# Altium schematic sheet chanel.SchDoc
size A2
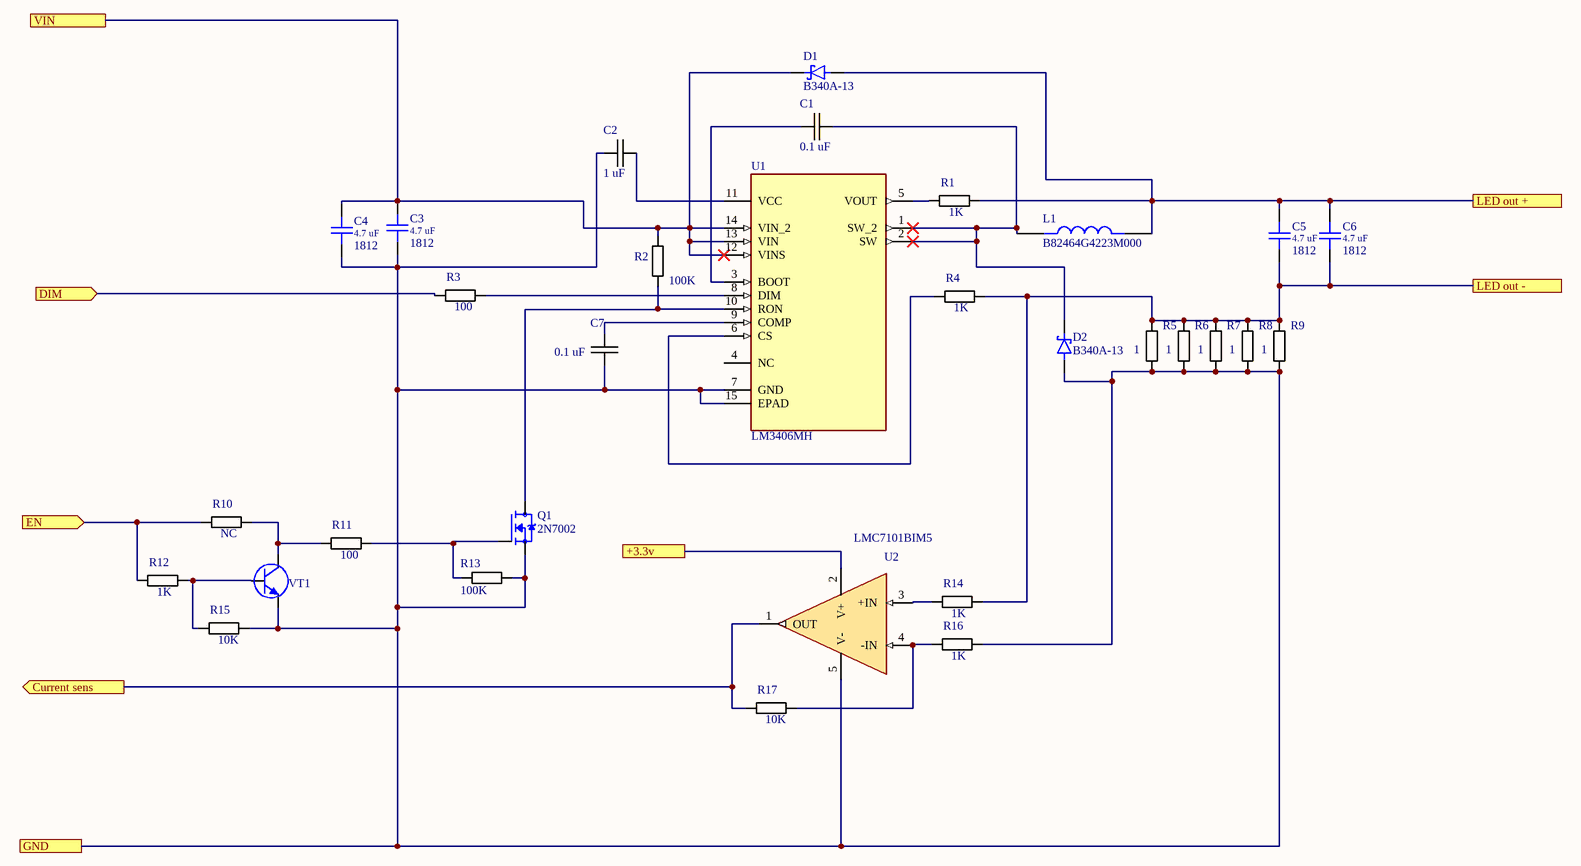
[diagram p0: chanel.SchDoc]

## Parts
C1  0.1 uF  [CAPACITOR 0603]
C2  1 uF  [CAPACITOR 0603]
C3  value 4.7 uF  Package: 1812  [CAPCHIP1812]  (hidden comment: Cap C)
C4  value 4.7 uF  Package: 1812  [CAPCHIP1812]  (hidden comment: Cap C)
C5  value 4.7 uF  Package: 1812  [CAPCHIP1812]  (hidden comment: Cap C)
C6  value 4.7 uF  Package: 1812  [CAPCHIP1812]  (hidden comment: Cap C)
C7  0.1 uF  [CAPACITOR 0603]
D1  B340A-13  [DIOM5226X240N]
D2  B340A-13  [DIOM5226X240N]
L1  B82464G4223M000  [IND_B82464G4223M000]
Q1  2N7002  [SOT95P240X111-3N]
R1  1K  [Resistor 0402]
R2  100K  [Resistor 0402]
R3  100  [Resistor 0402]
R4  1K  [Resistor 0402]
R5  1  [Resistor 1206]
R6  1  [Resistor 1206]
R7  1  [Resistor 1206]
R8  1  [Resistor 1206]
R9  1  [Resistor 1206]
R10  NC  [Resistor 0402]
R11  100  [Resistor 0402]
R12  1K  [Resistor 0402]
R13  100K  [Resistor 0402]
R14  1K  [Resistor 0402]
R15  10K  [Resistor 0402]
R16  1K  [Resistor 0402]
R17  10K  [Resistor 0402]
U1  LM3406MH  [SOP65P640X110-15N]
U2  LMC7101BIM5  [*SOT95P280X145-5N]
VT1  NPN BEC  [SOT23]  (value not drawn)

## Ports
+3.3v, Current sens (out), DIM (in), EN (in), GND, LED out +, LED out -, VIN

## Nets
+3.3v: U2.2(V+) ; port +3.3v
Current sens: R17.2 U2.1(OUT) ; port Current sens
DIM: R3.2 ; port DIM
EN: R10.2 R12.2 ; port EN
GND: C2.2 C3.1 C4.1 C7.2 D2.A Q1.2(S) R5.2 R6.2 R7.2 R8.2 R9.2 R13.1 R15.1 R16.1 U1.7(GND) U1.15(EPAD) U2.5(V-) VT1.2(E) ; port GND
LED out +: C5.2 C6.2 D1.A L1.2 R1.1 ; port LED out +
LED out -: C5.1 C6.1 R4.1 R5.1 R6.1 R7.1 R8.1 R9.1 R14.1 ; port LED out -
VIN: C3.2 C4.2 D1.C R2.2 U1.12(VINS) U1.13(VIN) U1.14(VIN_2) ; port VIN
NetC1_1: C1.1 D2.C L1.1 U1.1(SW_2) U1.2(SW)
NetC1_2: C1.2 U1.3(BOOT)
NetC2_1: C2.1 U1.11(VCC)
NetC7_1: C7.1 U1.9(COMP)
NetQ1_1: Q1.1(G) R11.1 R13.2
NetQ1_3: Q1.3(D) R2.1 U1.10(RON)
NetR1_2: R1.2 U1.5(VOUT)
NetR3_1: R3.1 U1.8(DIM)
NetR4_2: R4.2 U1.6(CS)
NetR10_1: R10.1 R11.2 VT1.3(C)
NetR12_1: R12.1 R15.2 VT1.1(B)
NetR14_2: R14.2 U2.3(+IN)
NetR16_2: R16.2 R17.1 U2.4(-IN)

Not connected (* = marked no-connect by the designer): U1 4(NC)

## Library data of the parts
C1 C2 C7 = Capasitor: Package: 0603
  C1 C7: Value: 0.1 uF
  C2: Value: 1 uF
C3-C6 = Cap C: Ceramic Capacitor; Class: Электронные компоненты; SubClass: Конденсаторы; TKE: {TKE}; Ordering_Information: {Ordering_Information}; Installation: {Installation}; Body: {Body}; Nominal_voltage_V: {Nominal_voltage_V}; Tolerance_Percent: {Tolerance_Percent}; Pins: {Pins}
D1 D2 = B340A-13: Diode Schottky 40 V 3A Surface Mount SMA; MF: Diodes Inc.; Value: *; MP: B340A-13; Package: DO-214 Diodes Inc.; Availability: In Stock; Price: None; SnapEDA_Link: https://www.snapeda.com/parts/B340A-13/Diodes+Inc./view-part/?ref=snap; Check_prices: https://www.snapeda.com/parts/B340A-13/Diodes+Inc./view-part/?ref=eda; Purchase-URL: https://pricing.snapeda.com/search/part/B340A-13/?ref=eda
L1 = B82464G4223M000: MF: TDK ELECTRONICS; Check_prices: https://www.snapeda.com/parts/B82464G4223M000/TM+Electronics/view-part/?ref=eda; Package: None; Value: *; MP: B82464G4223M000; SnapEDA_Link: https://www.snapeda.com/parts/B82464G4223M000/TM+Electronics/view-part/?ref=snap; Purchase-URL: https://pricing.snapeda.com/search/part/B82464G4223M000/?ref=eda
Q1 = 2N7002: N-Channel 60V 280mA (Ta) 350mW (Ta) Surface Mount SOT-23-3 (TO-236); MP: altium_native_batch; Package: None; Price: None; Availability: Unavailable; Value: *
R1-R17 = Resistor
  R1 R4 R12 R14 R16: Value: 1K; Package: 0402
  R2 R13: Value: 100K; Package: 0402
  R3 R11: Value: 100; Package: 0402
  R5-R9: Value: 1; Package: 1206
  R10: Value: NC; Package: 0402
  R15 R17: Value: 10K; Package: 0402
U1 = LM3406MH: Constant Current Buck Regulator; Package: None; Price: None; Value: *; MP: LM3406MH; Availability: Unavailable
VT1 = BC846: NPN Bipolar Transistor; Published: 17.04.2012; Publisher: Reukov A.V.
U2 = LMC7101BIM5: Check_prices: https://www.snapeda.com/parts/LMC7101BIM5/Texas%20Instruments/view-part/19255/?ref=eda; SnapEDA_Link: https://www.snapeda.com/parts/LMC7101BIM5/Texas%20Instruments/view-part/19255/?ref=snap; Value: *